# EAGLE schematic schematic_V2 (EAGLE 9.0.1)
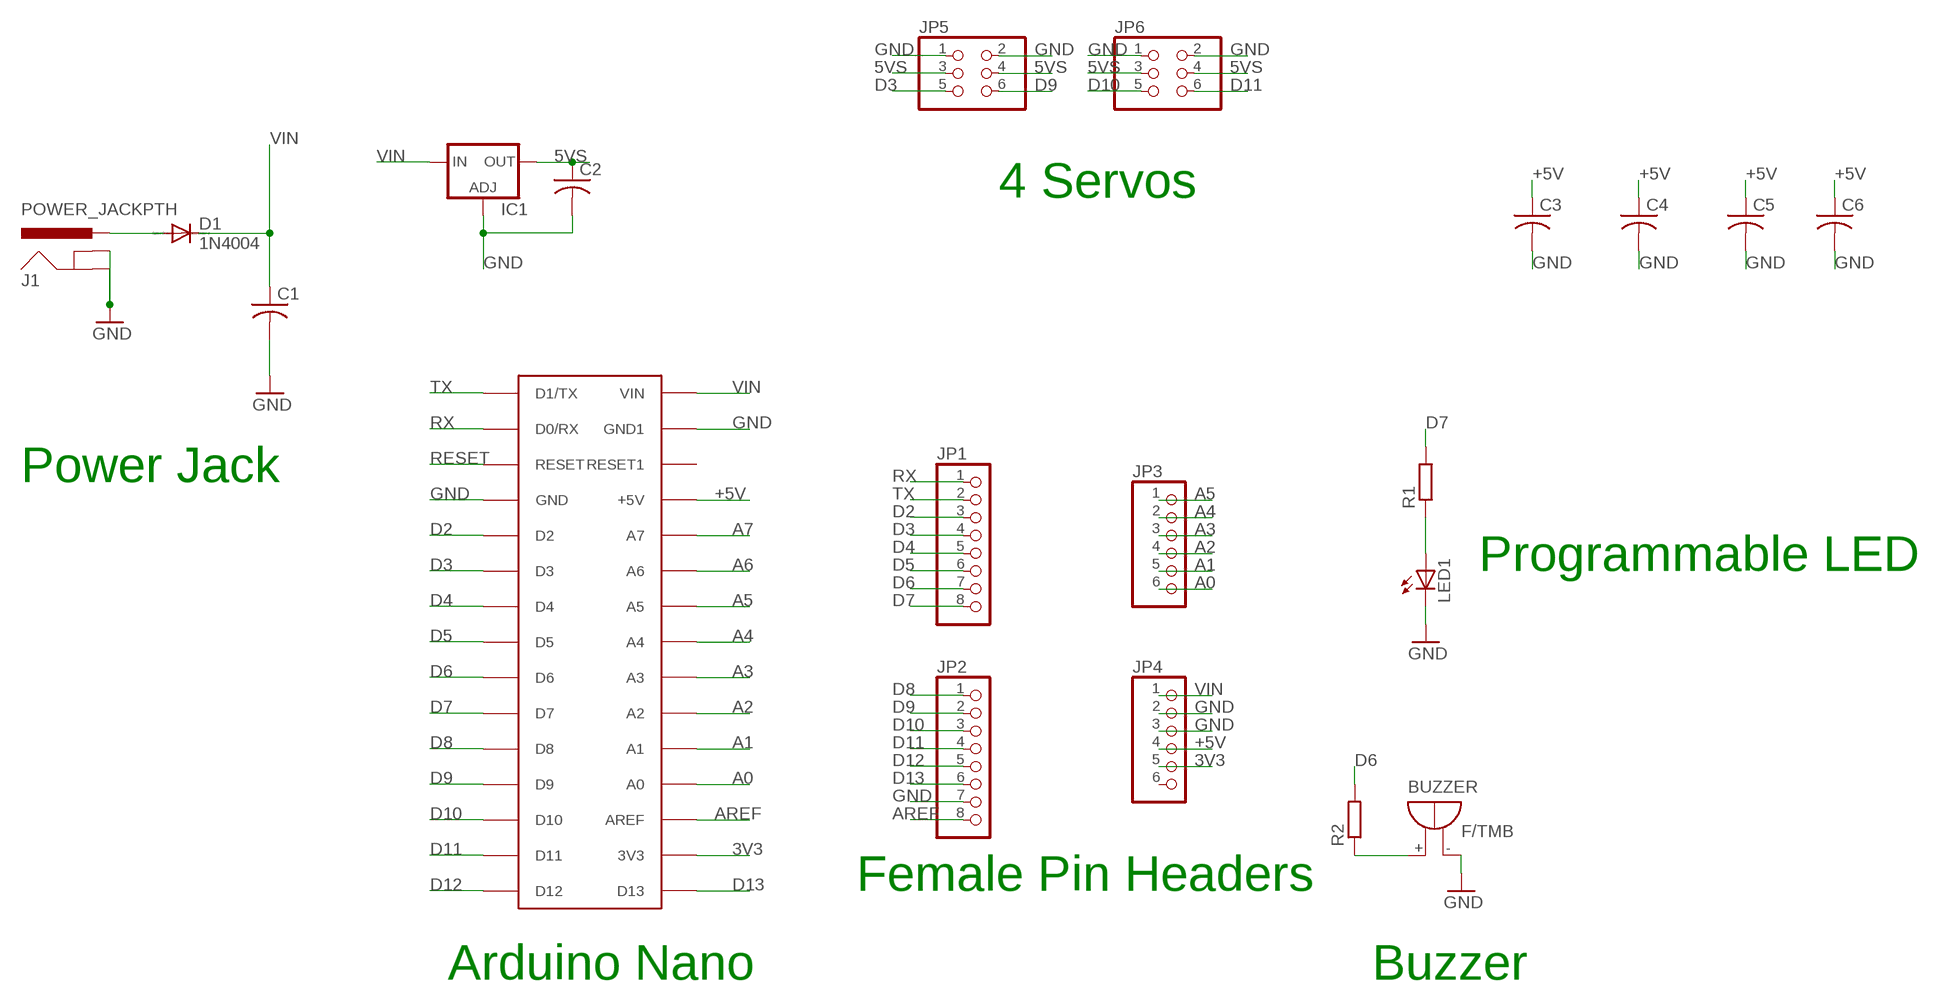
[diagram p0: schematic, sheet 1]

## Parts
BUZZER  F/TMB  [F/TMB]
C1  C-USC1206  [C1206]
C2  C-USC1206  [C1206]
C3  C-USC1206  [C1206]
C4  C-USC1206  [C1206]
C5  C-USC1206  [C1206]
C6  C-USC1206  [C1206]
D1  1N4004  [DO41-10]
IC1  LD117AS33TR  [SOT223]
J1  POWER_JACKPTH  [POWER_JACK_PTH]
JP1  PINHD-1X8  [1X08]
JP2  PINHD-1X8  [1X08]
JP3  PINHD-1X6  [1X06]
JP4  PINHD-1X6  [1X06]
JP5  PINHD-2X3  [2X03]
JP6  PINHD-2X3  [2X03]
LED1  LED5MM  [LED5MM]
R1  R-EU_0207/10  [0207/10]
R2  R-EU_0207/10  [0207/10]
U$1  ARDUINONANO  [PDIP-32]

## Nets
3V3: JP4.5 U$1.3V3
5VS: C2.1 IC1.4(OUT) JP5.3 JP5.4 JP6.3 JP6.4
+5V: C3.1 C4.1 C5.1 C6.1 JP4.4 U$1.+5V
A0: JP3.6 U$1.A7(A0)
A1: JP3.5 U$1.A6(A1)
A2: JP3.4 U$1.A5(A2)
A3: JP3.3 U$1.A4(A3)
A4: JP3.2 U$1.A3(A4)
A5: JP3.1 U$1.A2(A5)
A6: U$1.A1(A6)
A7: U$1.A0(A7)
AREF: JP2.8 U$1.AREF
D2: JP1.3 U$1.D2
D3: JP1.4 JP5.5 U$1.D3
D4: JP1.5 U$1.D4
D5: JP1.6 U$1.D5
D6: JP1.7 R2.2 U$1.D6
D7: JP1.8 R1.2 U$1.D7
D8: JP2.1 U$1.D8
D9: JP2.2 JP5.6 U$1.D9
D10: JP2.3 JP6.5 U$1.D10
D11: JP2.4 JP6.6 U$1.D11
D12: JP2.5 U$1.D12
D13: JP2.6 U$1.D13
GND: BUZZER.- C1.2 C2.2 C3.2 C4.2 C5.2 C6.2 IC1.1(ADJ) J1.GND J1.GNDBREAK JP2.7 JP4.2 JP4.3 JP5.1 JP5.2 JP6.1 JP6.2 LED1.K(C) U$1.GND U$1.GND1
N$1: LED1.A R1.1
N$2: D1.A J1.PWR
N$4: BUZZER.+ R2.1
RESET: U$1.RESET
RX: JP1.1 U$1.D0/RX
TX: JP1.2 U$1.D1/TX
VIN: C1.1 D1.C IC1.3(IN) JP4.1 U$1.VIN
Unconnected: JP4.6 U$1.RESET1

## Notes on the sheet
- 4 Servos
- Power Jack
- Programmable LED
- Female Pin Headers
- Arduino Nano | Buzzer

## Library data of the parts
BUZZER = buzzer:F/TMB: BUZZER Source: Buerklin; OC_FARNELL: unknown; OC_NEWARK: unknown
C1-C6 = adafruit:C-US: CAPACITOR, American symbol
D1 = diode:1N4004: DIODE general purpose rectifier, 1 A
IC1 = v-reg:LD117A?*: Low drop fixed and adjustable positive voltage regulators 1 A Source: http://www.st.com/stonline/products/literature/ds/7194/ld1117axx.pdf
J1 = SparkFun:POWER_JACK: Power Jack This is the standard 5.5mm barrel jack for power. The PTH is the most common, proven, reliable, footprint. All others are experimental. The Slot footprint only works if the mill layer is transmitted to the PCB fab house so be warned. Spark Fun Electronics SKU : PRT-00119. Mating wall wart : TOL-00298 (and others)
JP1 JP2 = pinhead:PINHD-1X8: PIN HEADER
JP3 JP4 = pinhead:PINHD-1X6: PIN HEADER
JP5 JP6 = pinhead:PINHD-2X3: PIN HEADER
LED1 = led:LED: LED OSRAM: - CHIPLED LG R971, LG N971, LY N971, LG Q971, LY Q971, LO R971, LY R971 LH N974, LH R974 LS Q976, LO Q976, LY Q976 LO Q996 - Hyper CHIPLED LW Q18S LB Q993, LB Q99A, LB R99A - SideLED LS A670, LO A670, LY A670, LG A670, LP A670 LB A673, LV A673, LT A673, LW A673 LH A674 LY A675 LS A676, LA A676, LO A676, LY A676, LW A676 LS A679, LY A679, LG A679 - Hyper Micro SIDELED® LS Y876, LA Y876, LO Y876, LY Y876 LT Y87S - SmartLED LW L88C, LW L88S LB L89C, LB L89S, LG L890 LS L89K, LO L89K, LY L89K LS L896, LA L896, LO L896, LY L896 - TOPLED LS T670, LO T670, LY T670, LG T670, LP T670 LSG T670, LSP T670, LSY T670, LOP T670, LYG T670 LG T671, LOG T671, LSG T671 LB T673, LV T673, LT T673, LW T673 LH T674 LS T676, LA T676, LO T676, LY T676, LB T676, LH T676, LSB T676, LW T676 LB T67C, LV T67C, LT T67C, LS T67K, LO T67K, LY T67K, LW E67C LS E67B, LA E67B, LO E67B, LY E67B, LB E67C, LV E67C, LT E67C LW T67C LS T679, LY T679, LG T679 LS T770, LO T770, LY T770, LG T770, LP T770 LB T773, LV T773, LT T773, LW T773 LH T774 LS E675, LA E675, LY E675, LS T675 LS T776, LA T776, LO T776, LY T776, LB T776 LHGB T686 LT T68C, LB T68C - Hyper Mini TOPLED® LB M676 - Mini TOPLED Santana® LG M470 LS M47K, LO M47K, LY M47K Source: http://www.osram.convergy.de LUXEON: - LUMILED® LXK2-PW12-R00, LXK2-PW12-S00, LXK2-PW14-U00, LXK2-PW14-V00 LXK2-PM12-R00, LXK2-PM12-S00, LXK2-PM14-U00 LXK2-PE12-Q00, LXK2-PE12-R00, LXK2-PE12-S00, LXK2-PE14-T00, LXK2-PE14-U00 LXK2-PB12-K00, LXK2-PB12-L00, LXK2-PB12-M00, LXK2-PB14-N00, LXK2-PB14-P00, LXK2-PB14-Q00 LXK2-PR12-L00, LXK2-PR12-M00, LXK2-PR14-Q00, LXK2-PR14-R00 LXK2-PD12-Q00, LXK2-PD12-R00, LXK2-PD12-S00 LXK2-PH12-R00, LXK2-PH12-S00 LXK2-PL12-P00, LXK2-PL12-Q00, LXK2-PL12-R00 Source: www.luxeon.com KINGBRIGHT: KA-3528ASYC Source: www.kingbright.com
R1 R2 = rcl:R-EU_: RESISTOR, European symbol
U$1 = rocketfarm:ARDUINONANO